# EAGLE design powerboard (EAGLE 7.6.0)
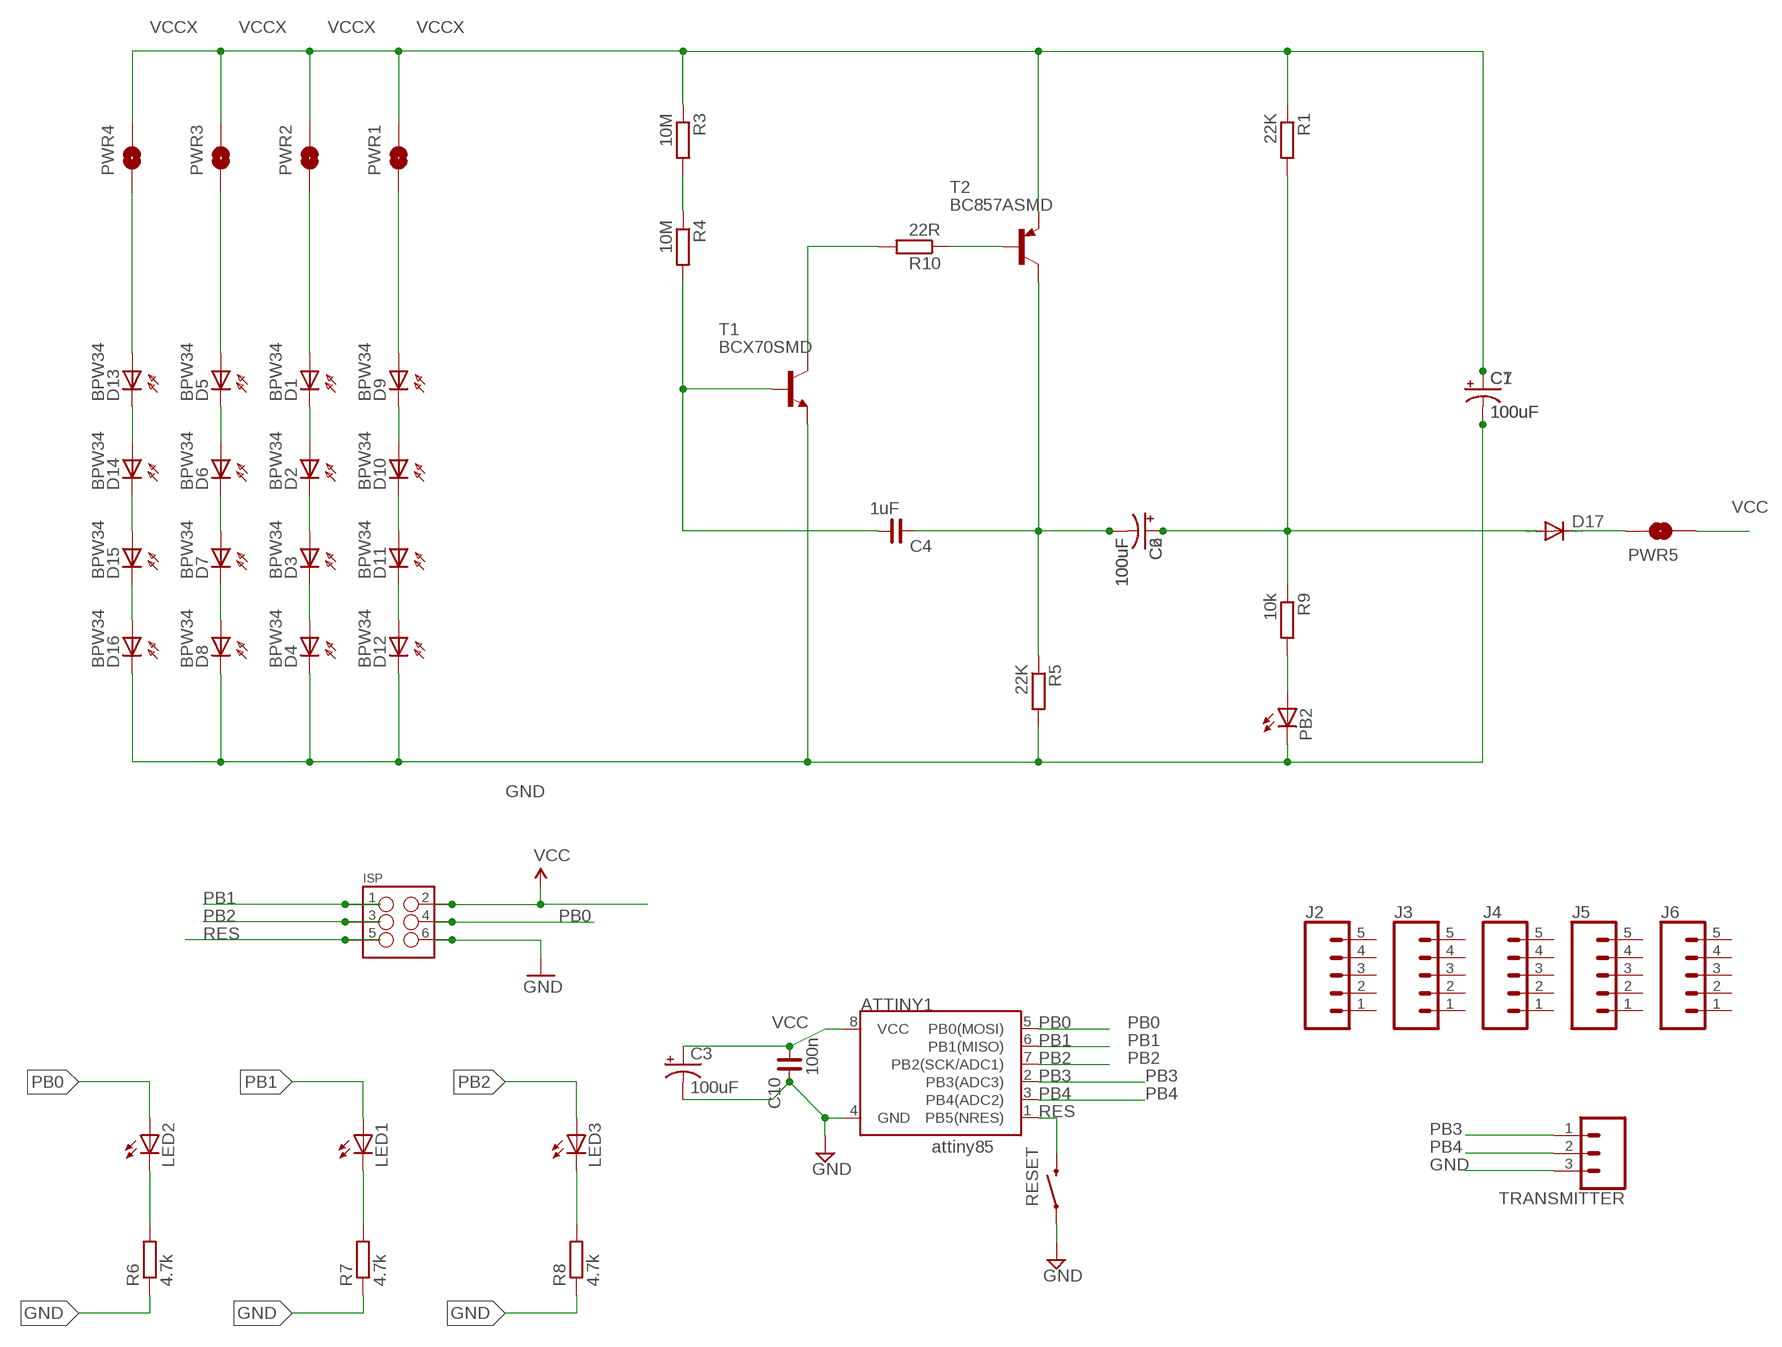
[diagram p0: schematic, sheet 1]

## Parts
ATTINY1  ATTINY45DIP8  [DIP08]
C1  100uF  CAP_POLPTH2  [CPOL-RADIAL-10UF-25V]
C2  100uF  CAP_POLPTH2  [CPOL-RADIAL-10UF-25V]
C3  100uF  CAP_POLPTH2  [CPOL-RADIAL-10UF-25V]
C4  1uF  C_0805  [C0805]
C6  100uF  CAP_POL1206  [EIA3216]
C7  100uF  CAP_POL1206  [EIA3216]
C10  100n  C_1206  [C1206]
D1  BPW34  BP104  [BP104]
D2  BPW34  BP104  [BP104]
D3  BPW34  BP104  [BP104]
D4  BPW34  BP104  [BP104]
D5  BPW34  BP104  [BP104]
D6  BPW34  BP104  [BP104]
D7  BPW34  BP104  [BP104]
D8  BPW34  BP104  [BP104]
D9  BPW34  BP104  [BP104]
D10  BPW34  BP104  [BP104]
D11  BPW34  BP104  [BP104]
D12  BPW34  BP104  [BP104]
D13  BPW34  BP104  [BP104]
D14  BPW34  BP104  [BP104]
D15  BPW34  BP104  [BP104]
D16  BPW34  BP104  [BP104]
D17  DIODE-DO214AA  [DO214AA]
ISP  M03X2NO_SILK  [2X3-NS@1]
J2  CONN_05NO_SILK  [1X05_NO_SILK]
J3  CONN_05NO_SILK  [1X05_NO_SILK]
J4  CONN_05NO_SILK  [1X05_NO_SILK]
J5  CONN_05NO_SILK  [1X05_NO_SILK]
J6  CONN_05NO_SILK  [1X05_NO_SILK]
LED1  LEDCHIPLED_1206  [CHIPLED_1206]
LED2  LEDCHIPLED_1206  [CHIPLED_1206]
LED3  LEDCHIPLED_1206  [CHIPLED_1206]
PB2  LEDKA-3528ASYC  [KA-3528ASYC]
PWR1  SOLDERJUMPERNO  [SJ_2S-NO]
PWR2  SOLDERJUMPERNO  [SJ_2S-NO]
PWR3  SOLDERJUMPERNO  [SJ_2S-NO]
PWR4  SOLDERJUMPERNO  [SJ_2S-NO]
PWR5  SOLDERJUMPERNO  [SJ_2S-NO]
R1  22K  R-EU_R0805W  [R0805W]
R3  10M  R-EU_R0805W  [R0805W]
R4  10M  R-EU_R0805W  [R0805W]
R5  22K  R-EU_R0805W  [R0805W]
R6  4.7k  R-EU_R1206W  [R1206W]
R7  4.7k  R-EU_R1206W  [R1206W]
R8  4.7k  R-EU_R1206W  [R1206W]
R9  10k  R-EU_R0805W  [R0805W]
R10  22R  R-EU_R0805  [R0805]
RESET  SWITCH-MOMENTARY-2PTH  [TACTILE-PTH]
T1  BCX70SMD  [SOT23]
T2  BC857ASMD  [SOT23-BEC]
TRANSMITTER  CONN_03LONGPADS  [1X03_LONGPADS]

## Nets
GND [c]: ATTINY1.4(GND) C1.2(-) C3.2(-) C7.C(-) C10.2 D4.K(C) D8.K(C) D12.K(C) D16.K(C) ISP.6 PB2.C R5.2 R6.1 R7.1 R8.1 RESET.1 T1.2(E) TRANSMITTER.3
N$1: R10.1 T2.B
N$2: R10.2 T1.3(C)
N$3: D9.A PWR1.1
N$4: C2.1(+) C6.A(+) D17.A R1.2 R9.1
N$5: R3.2 R4.1
N$6: LED2.C R6.2
N$7: D9.K(C) D10.A
N$8: D10.K(C) D11.A
N$9: C2.2(-) C4.2 C6.C(-) R5.1 T2.C
N$10: D11.K(C) D12.A
N$11: D1.A PWR2.1
N$12: D1.K(C) D2.A
N$13: D2.K(C) D3.A
N$14: D3.K(C) D4.A
N$15: D5.A PWR3.1
N$16: D5.K(C) D6.A
N$17: D6.K(C) D7.A
N$18: D7.K(C) D8.A
N$19: D13.A PWR4.1
N$20: D13.K(C) D14.A
N$21: D14.K(C) D15.A
N$22: D15.K(C) D16.A
N$23: LED1.C R7.2
N$24: LED3.C R8.2
N$25: PB2.A R9.2
N$26: D17.C PWR5.2
PB0: ATTINY1.5(PB0(MOSI)) ISP.4 LED2.A
PB1: ATTINY1.6(PB1(MISO)) ISP.1 LED1.A
PB2: ATTINY1.7(PB2(SCK/ADC1)) ISP.3 LED3.A
PB3: ATTINY1.2(PB3(ADC3)) TRANSMITTER.1
PB4: ATTINY1.3(PB4(ADC2)) TRANSMITTER.2
RES: ATTINY1.1(PB5(NRES)) ISP.5 RESET.3
VCC: ATTINY1.8(VCC) C3.1(+) C10.1 ISP.2 PWR5.1
VCCX: C1.1(+) C7.A(+) PWR1.2 PWR2.2 PWR3.2 PWR4.2 R1.1 R3.1 T2.E
XX: C4.1 R4.2 T1.1(B)
Unconnected: J2.1 J2.2 J2.3 J2.4 J2.5 J3.1 J3.2 J3.3 J3.4 J3.5 J4.1 J4.2 J4.3 J4.4 J4.5 J5.1 J5.2 J5.3 J5.4 J5.5 J6.1 J6.2 J6.3 J6.4 J6.5

## Notes on the sheet
- attiny85

## Library data of the parts
ATTINY1 = SparkFun:ATTINY45: Atmel ATTiny45
C1-C3 C6 C7 = SparkFun-Passives:CAP_POL: Capacitor Polarized These are standard SMD and PTH capacitors. Normally 10uF, 47uF, and 100uF in electrolytic and tantalum varieties. Always verify the external diameter of the through hole cap, it varies with capacity, voltage, and manufacturer. The EIA devices should be standard.
C4 C10 = rc-master-smd:C_: NON-POLARIZED CAP
D1-D16 = opto-trans-siemens:BP104: PHOTO DIODE
D17 = diode:DIODE-: DIODE
ISP = SparkFun-Connectors:M03X2: 2x3 .1" header. Shrouded, with keying- CONN-10681 SMT- CONN-11415 Pogo pins- HW-11044
J2-J6 = SparkFun-Connectors:CONN_05: Multi connection point. Often used as Generic Header-pin footprint for 0.1 inch spaced/style header connections On any of the 0.1 inch spaced packages, you can populate with these: Break Away Headers - Straight <https://www.sparkfun.com/products/116> (PRT-00116) Break Away Male Headers - Right Angle <https://www.sparkfun.com/products/553> (PRT-00553) Female Headers <https://www.sparkfun.com/products/115> (PRT-00115) Break Away Headers - Machine Pin <https://www.sparkfun.com/products/117> (PRT-00117) Break Away Female Headers - Swiss Machine Pin <https://www.sparkfun.com/products/743> (PRT-00743) For SCREWTERMINALS and SPRING TERMINALS visit here: Screw Terimnals on SparkFun.com <https://www.sparkfun.com/search/results?term=Screw+Terminals> (5mm/3.5mm/2.54mm spacing) This device is also useful as a general connection point to wire up your design to another part of your project. Our various solder wires solder well into these plated through hole pads. Hook-Up Wire - Assortment (Stranded, 22 AWG) <https://www.sparkfun.com/products/11375> (PRT-11375) Hook-Up Wire - Assortment (Solid Core, 22 AWG) <https://www.sparkfun.com/products/11367> (PRT-11367) View the entire wire category on our website here <https://www.sparkfun.com/categories/141> Special notes: Molex polarized connector foot print use with SKU : PRT-08231 with associated crimp pins and housings. 1MM SMD Version SKU: PRT-10208
LED1-LED3 PB2 = led:LED: LED OSRAM: - CHIPLED LG R971, LG N971, LY N971, LG Q971, LY Q971, LO R971, LY R971 LH N974, LH R974 LS Q976, LO Q976, LY Q976 LO Q996 - Hyper CHIPLED LW Q18S LB Q993, LB Q99A, LB R99A - SideLED LS A670, LO A670, LY A670, LG A670, LP A670 LB A673, LV A673, LT A673, LW A673 LH A674 LY A675 LS A676, LA A676, LO A676, LY A676, LW A676 LS A679, LY A679, LG A679 - Hyper Micro SIDELED® LS Y876, LA Y876, LO Y876, LY Y876 LT Y87S - SmartLED LW L88C, LW L88S LB L89C, LB L89S, LG L890 LS L89K, LO L89K, LY L89K LS L896, LA L896, LO L896, LY L896 - TOPLED LS T670, LO T670, LY T670, LG T670, LP T670 LSG T670, LSP T670, LSY T670, LOP T670, LYG T670 LG T671, LOG T671, LSG T671 LB T673, LV T673, LT T673, LW T673 LH T674 LS T676, LA T676, LO T676, LY T676, LB T676, LH T676, LSB T676, LW T676 LB T67C, LV T67C, LT T67C, LS T67K, LO T67K, LY T67K, LW E67C LS E67B, LA E67B, LO E67B, LY E67B, LB E67C, LV E67C, LT E67C LW T67C LS T679, LY T679, LG T679 LS T770, LO T770, LY T770, LG T770, LP T770 LB T773, LV T773, LT T773, LW T773 LH T774 LS E675, LA E675, LY E675, LS T675 LS T776, LA T776, LO T776, LY T776, LB T776 LHGB T686 LT T68C, LB T68C - Hyper Mini TOPLED® LB M676 - Mini TOPLED Santana® LG M470 LS M47K, LO M47K, LY M47K Source: http://www.osram.convergy.de LUXEON: - LUMILED® LXK2-PW12-R00, LXK2-PW12-S00, LXK2-PW14-U00, LXK2-PW14-V00 LXK2-PM12-R00, LXK2-PM12-S00, LXK2-PM14-U00 LXK2-PE12-Q00, LXK2-PE12-R00, LXK2-PE12-S00, LXK2-PE14-T00, LXK2-PE14-U00 LXK2-PB12-K00, LXK2-PB12-L00, LXK2-PB12-M00, LXK2-PB14-N00, LXK2-PB14-P00, LXK2-PB14-Q00 LXK2-PR12-L00, LXK2-PR12-M00, LXK2-PR14-Q00, LXK2-PR14-R00 LXK2-PD12-Q00, LXK2-PD12-R00, LXK2-PD12-S00 LXK2-PH12-R00, LXK2-PH12-S00 LXK2-PL12-P00, LXK2-PL12-Q00, LXK2-PL12-R00 Source: www.luxeon.com KINGBRIGHT: KA-3528ASYC Source: www.kingbright.com
PWR1-PWR5 = SparkFun:SOLDERJUMPER: Solder Jumper Standard SMD solder jumper. Used to automate production. Two varients : Normally Open and Normally Closed are the same, but have different paste layers. NC will have a large amount of paste and should jumper during reflow.
R1 R3-R5 R9 R10 = resistor:R-EU_: RESISTOR, European symbol
R6-R8 = rcl:R-EU_: RESISTOR, European symbol
RESET = SparkFun:SWITCH-MOMENTARY-2
T1 = transistor-npn:BCX70*: NPN Transistor
T2 = transistor-pnp:BC857*: PNP Transistror
TRANSMITTER = SparkFun-Connectors:CONN_03: Multi connection point. Often used as Generic Header-pin footprint for 0.1 inch spaced/style header connections On any of the 0.1 inch spaced packages, you can populate with these: Break Away Headers - Straight <https://www.sparkfun.com/products/116> (PRT-00116) Break Away Male Headers - Right Angle <https://www.sparkfun.com/products/553> (PRT-00553) Female Headers <https://www.sparkfun.com/products/115> (PRT-00115) Break Away Headers - Machine Pin <https://www.sparkfun.com/products/117> (PRT-00117) Break Away Female Headers - Swiss Machine Pin <https://www.sparkfun.com/products/743> (PRT-00743) Stackable Header - 3 Pin (Female, 0.1") <https://www.sparkfun.com/products/13875> (PRT-13875) For SCREWTERMINALS and SPRING TERMINALS visit here: Screw Terimnals on SparkFun.com <https://www.sparkfun.com/search/results?term=Screw+Terminals> (5mm/3.5mm/2.54mm spacing) This device is also useful as a general connection point to wire up your design to another part of your project. Our various solder wires solder well into these plated through hole pads. Hook-Up Wire - Assortment (Stranded, 22 AWG) <https://www.sparkfun.com/products/11375> (PRT-11375) Hook-Up Wire - Assortment (Solid Core, 22 AWG) <https://www.sparkfun.com/products/11367> (PRT-11367) View the entire wire category on our website here <https://www.sparkfun.com/categories/141> Special notes: Molex polarized connector foot print use with SKU : PRT-08232 with associated crimp pins and housings.

## Net classes
0 vcc: width 0.381 mm, drill 0.381 mm, clearance 0.381 mm
1 X: width 0.381 mm, drill 0.381 mm, clearance 0.381 mm
2 c: width 0.381 mm, drill 0.381 mm, clearance 0.381 mm

## Board
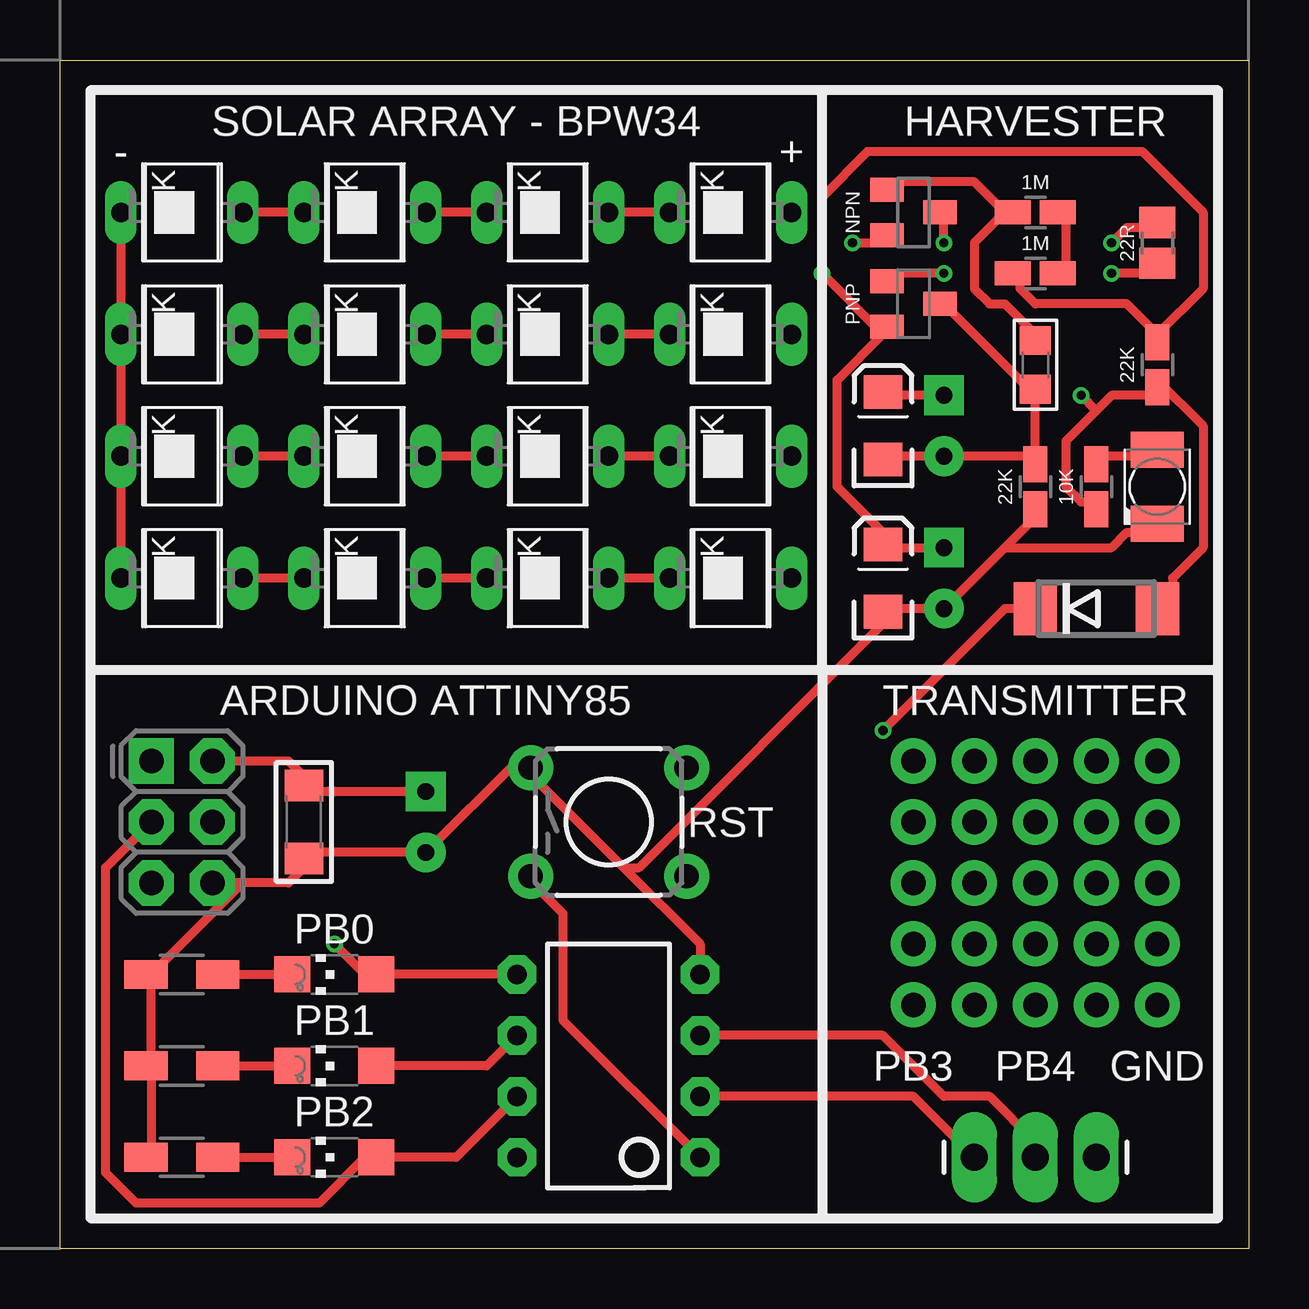
[diagram p1: board, top side]
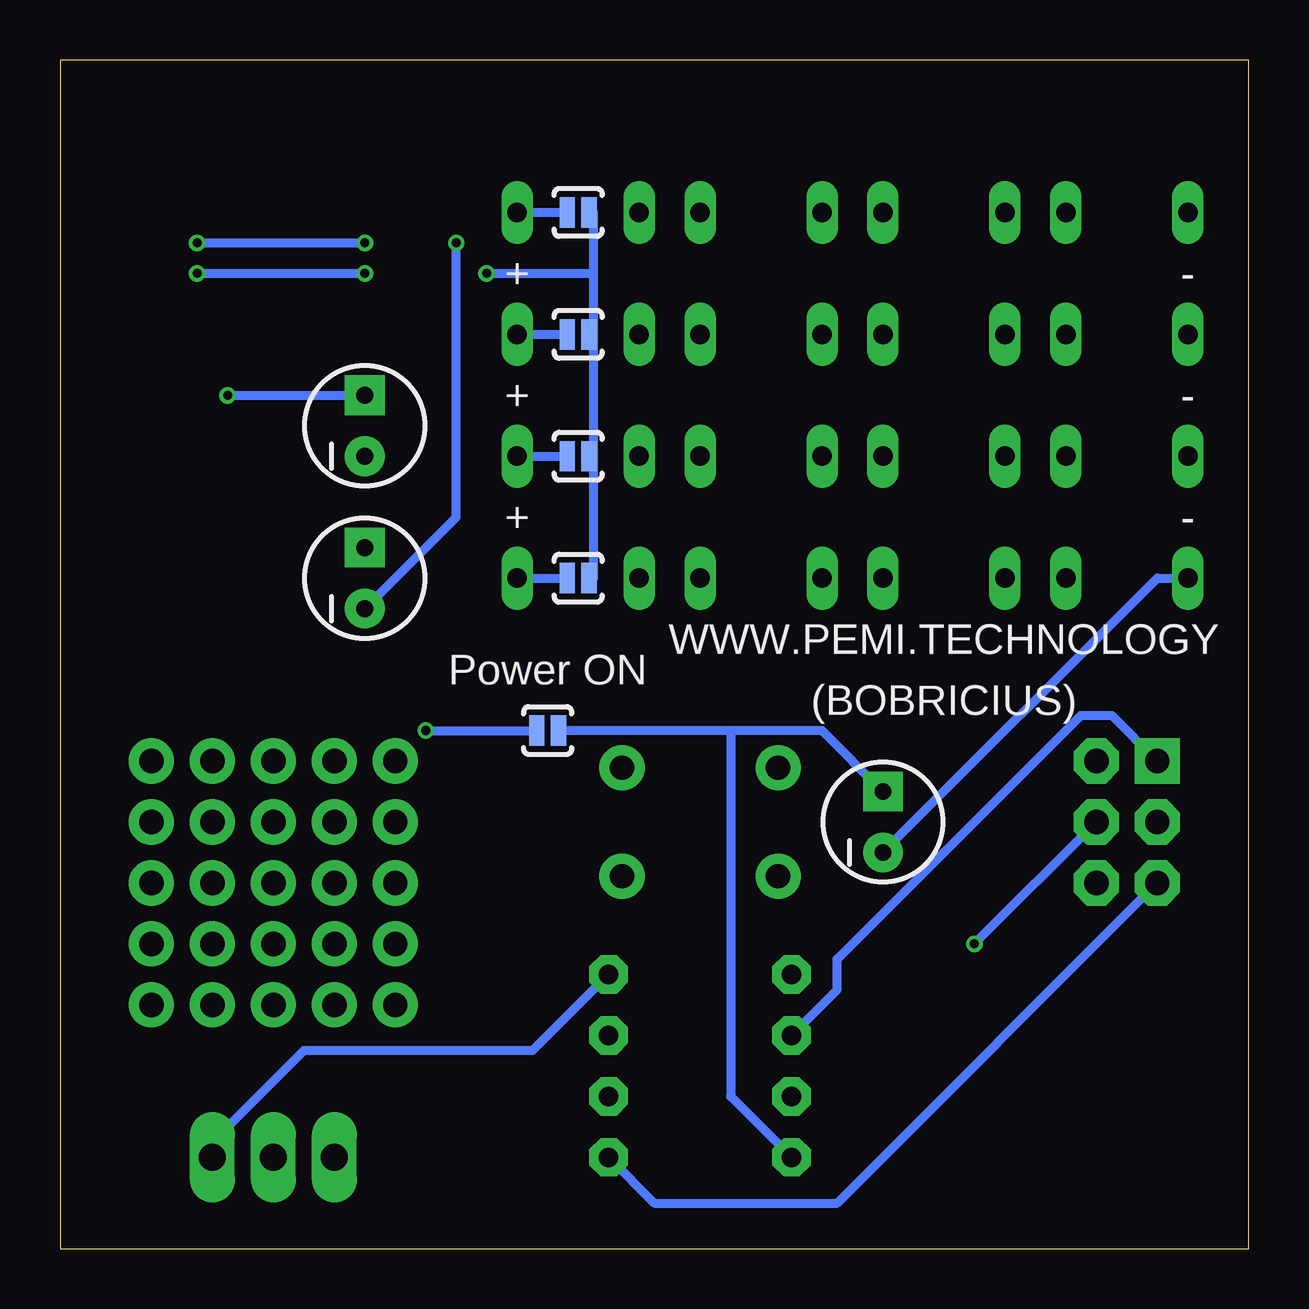
[diagram p2: board, bottom side, seen from below]

Size 49.53 x 49.53 mm. Coordinates in mm from the lower left corner, seen from the top.
Outline: 0,49.53 49.53,49.53 49.53,0 0,0 0,49.53
Copper layers (1*16): Top 0.035mm / dielectric 1.5mm / Bottom 0.035mm
Design rules "ITEADstudio_DRC *": minimum track width 6mil, minimum drill 12mil, track to track 6mil, track to pad 6mil, pad to pad 6mil, via to via 6mil, smd to smd 0mil, copper to edge 20mil, drill to drill 8mil, minimum pad ring 10mil, minimum via ring 6mil, stop-mask expansion 2mil, vias tented up to drill 100mil, thermal gap 10mil

### Footprints (pad centres in the part's own frame; a part is rotated, then mirrored left to right if it is on the bottom)
DIP08 = drill 0.813 pad 1.6 octagon: 1 -3.81,-3.81; 2 -1.27,-3.81; 3 1.27,-3.81; 4 3.81,-3.81; 5 3.81,3.81; 6 1.27,3.81; 7 -1.27,3.81; 8 -3.81,3.81
CPOL-RADIAL-10UF-25V = drill 0.7 pad 1.651 square: 1 1.27,0 | drill 0.7 pad 1.651: 2 -1.27,0
C0805 = smd 1.2 x 1.3: 1 -1.016,0; 2 1.016,0
EIA3216 = smd 1.4 x 1.6: A 1.4,0; C -1.4,0
C1206 = smd 1.3 x 1.6: 1 -1.524,0; 2 1.524,0
BP104 = drill 0.813 long: A 0,2.54; K 0,-2.54
DO214AA = smd 1.8 x 2.2: A 2.55,0; C -2.55,0
2X3-NS@1 = drill 1.016 pad 1.88 square: 1 -2.54,-1.27 | drill 1.016 pad 1.88 octagon: 2 -2.54,1.27; 3 0,-1.27; 4 0,1.27; 5 2.54,-1.27; 6 2.54,1.27
1X05_NO_SILK = drill 1.016 pad 1.88: 1 0,0; 2 2.54,0; 3 5.08,0; 4 7.62,0; 5 10.16,0
CHIPLED_1206 = smd 1.5 x 1.5: A 0,-1.75; C 0,1.75
KA-3528ASYC = smd 1.5 x 2.2: A -1.55,0; C 1.55,0
SJ_2S-NO = smd 0.635 x 1.27: 1 -0.45,0; 2 0.45,0
R0805W = smd 1.5 x 1: 1 -0.94,0; 2 0.94,0
R1206W = smd 1.8 x 1.2: 1 -1.499,0; 2 1.499,0
R0805 = smd 1.3 x 1.5: 1 -0.85,0; 2 0.85,0
TACTILE-PTH = drill 1.016 pad 1.88: 1 -3.251,2.261; 2 3.251,2.261; 3 -3.251,-2.261; 4 3.251,-2.261
SOT23 = smd 1 x 1.4: 1 -0.95,-1.1; 2 0.95,-1.1; 3 0,1.1
SOT23-BEC = smd 1 x 1.4: B -0.95,-1.1; C 0,1.1; E 0.95,-1.1
1X03_LONGPADS = drill 1.118 pad 1.88 long: 1 0,0; 2 2.54,0; 3 5.08,0

### Placement (x,y rotation side)
ATTINY1  22.86,7.62 90 top
C1  36.83,27.94 90 bottom
C2  36.83,34.29 90 bottom
C3  15.24,17.78 90 bottom
C4  40.64,36.83 270 top
C6  34.29,34.29 90 top
C7  34.29,27.94 90 top
C10  10.16,17.78 270 top
D1  27.94,38.1 270 top
D2  20.32,38.1 270 top
D3  12.7,38.1 270 top
D4  5.08,38.1 270 top
D5  27.94,43.18 270 top
D6  20.32,43.18 270 top
D7  12.7,43.18 270 top
D8  5.08,43.18 270 top
D9  27.94,33.02 270 top
D10  20.32,33.02 270 top
D11  12.7,33.02 270 top
D12  5.08,33.02 270 top
D13  27.94,27.94 270 top
D14  20.32,27.94 270 top
D15  12.7,27.94 270 top
D16  5.08,27.94 270 top
D17  43.18,26.67 0 top
ISP  5.08,17.78 270 top
J2  35.56,20.32 0 top
J3  35.56,17.78 0 top
J4  35.56,15.24 0 top
J5  35.56,12.7 0 top
J6  35.56,10.16 0 top
LED1  11.43,7.62 90 top
LED2  11.43,11.43 90 top
LED3  11.43,3.81 90 top
PB2  45.72,31.75 270 top
PWR1  27.94,33.02 0 bottom
PWR2  27.94,38.1 0 bottom
PWR3  27.94,43.18 0 bottom
PWR4  27.94,27.94 0 bottom
PWR5  29.21,21.59 180 bottom
R1  45.72,36.83 270 top
R3  40.64,40.64 0 top
R4  40.64,43.18 180 top
R5  40.64,31.75 270 top
R6  5.08,11.43 0 top
R7  5.08,7.62 0 top
R8  5.08,3.81 0 top
R9  43.18,31.75 90 top
R10  45.72,41.91 90 top
RESET  22.86,17.78 0 top
T1  35.56,43.18 270 top
T2  35.56,39.37 270 top
TRANSMITTER  38.1,3.81 0 top

### Tracks (layer width: path | path; a pad name or v marks a point on that pad's centre or on a via)
GND  (via drill 0.38)
  Top 0.381: D16.K D12.K D4.K D8.K | 3.81,7.62 3.81,3.81 R8.1 | 3.81,7.62 3.81,11.43 | 3.81,7.62 R7.1 | 7.62,15.24 9.53,15.24 10.16,15.88 C10.2 10.16,16.51 C3.2 19.05,20.32 RESET.1 19.68,19.68 23.5,15.88 | 7.62,15.24 ISP.6 | 7.62,15.24 3.81,11.43 | 3.81,11.43 R6.1 | v33.02,41.91 34.29,41.91 T1.2 | 39.37,29.21 C1.2 34.29,26.67 C7.C 34.29,26.04 24.13,15.88 23.5,15.88 | 39.37,29.21 40.64,30.48 R5.2 | 39.37,29.21 43.81,29.21 44.45,29.84 45.72,29.84 PB2.C | ATTINY1.4 26.67,12.7 23.5,15.88
  Bottom 0.381: D16.K 3.81,27.94 C3.2 | v33.02,41.91 33.02,30.48 C1.2 | TRANSMITTER.3 43.18,4.45 39.37,8.26 29.84,8.26 ATTINY1.4
N$1  (via drill 0.38)
  Top 0.381: v36.83,40.64 34.92,40.64 T2.B | v43.81,40.64 45.72,40.64 R10.1
  Bottom 0.381: v43.81,40.64 v36.83,40.64
N$2  (via drill 0.38)
  Top 0.381: v36.83,41.91 36.83,43.18 T1.3 | v43.81,41.91 44.45,42.54 45.72,42.54 R10.2
  Bottom 0.381: v43.81,41.91 v36.83,41.91
N$3
  Bottom 0.381: D9.A PWR1.1
N$4  (via drill 0.38)
  Top 0.381: C2.1 34.29,35.56 C6.A | 43.18,34.92 43.81,35.56 45.72,35.56 R1.2 45.72,36.2 47.62,34.29 47.62,29.21 46.35,27.94 46.35,26.67 D17.A | 43.18,34.92 41.91,33.65 41.91,31.75 42.54,31.11 43.18,31.11 R9.1 | 43.18,34.92 v42.54,35.56
  Bottom 0.381: v42.54,35.56 C2.1
N$5
  Top 0.381: R3.2 41.91,40.64 41.91,43.18 R4.1
N$6
  Top 0.381: R6.2 LED2.C
N$7
  Top 0.381: D9.K D10.A
N$8
  Top 0.381: D10.K D11.A
N$9
  Top 0.381: C6.C 34.29,33.02 C2.2 40.64,33.02 | 40.64,33.02 40.64,35.56 | 40.64,35.56 36.83,39.37 T2.C | 40.64,35.56 C4.2 | 40.64,33.02 R5.1
N$10
  Top 0.381: D11.K D12.A
N$11
  Bottom 0.381: D1.A PWR2.1
N$12
  Top 0.381: D1.K D2.A
N$13
  Top 0.381: D2.K D3.A
N$14
  Top 0.381: D3.K D4.A
N$15
  Bottom 0.381: D5.A PWR3.1
N$16
  Top 0.381: D5.K D6.A
N$17
  Top 0.381: D6.K D7.A
N$18
  Top 0.381: D7.K D8.A
N$19
  Bottom 0.381: D13.A PWR4.1
N$20
  Top 0.381: D13.K D14.A
N$21
  Top 0.381: D14.K D15.A
N$22
  Top 0.381: D15.K D16.A
N$23
  Top 0.381: R7.2 LED1.C
N$24
  Top 0.381: R8.2 LED3.C
N$25
  Top 0.381: R9.2 43.18,33.02 45.72,33.02 PB2.A
N$26  (via drill 0.38)
  Top 0.381: v34.29,21.59 39.37,26.67 D17.C
  Bottom 0.381: v34.29,21.59 PWR5.2
PB0  (via drill 0.38)
  Top 0.381: ATTINY1.5 LED2.A 12.7,11.43 v11.43,12.7
  Bottom 0.381: v11.43,12.7 ISP.4
PB1
  Top 0.381: LED1.A 17.78,7.62 ATTINY1.6
  Bottom 0.381: ISP.1 5.71,22.23 6.99,22.23 17.14,12.07 17.14,10.79 ATTINY1.6
PB2
  Top 0.381: ATTINY1.7 16.51,3.81 LED3.A 12.7,3.81 10.79,1.9 3.18,1.9 1.9,3.18 1.9,15.88 ISP.3
PB3
  Top 0.381: ATTINY1.2 35.56,6.35 TRANSMITTER.1
PB4
  Top 0.381: ATTINY1.3 34.29,8.89 36.83,6.35 38.73,6.35 40.64,4.45 TRANSMITTER.2
RES
  Top 0.381: ATTINY1.1 20.96,9.53 20.96,13.97 19.68,15.24 RESET.3
  Bottom 0.381: ISP.5 17.14,1.9 24.77,1.9 ATTINY1.1
VCC
  Top 0.381: C3.1 10.16,19.05 C10.1 10.16,19.68 9.53,20.32 ISP.2
  Bottom 0.381: 21.59,21.59 17.78,21.59 C3.1 | 21.59,21.59 PWR5.1 | ATTINY1.8 21.59,6.35 21.59,21.59
VCCX  (via drill 0.38)
  Top 0.381: 45.72,38.1 44.45,39.37 40.64,39.37 40,40 40,40.64 R3.1 | 34.29,38.1 32.38,36.2 32.38,31.75 34.29,29.84 C7.A 34.29,29.21 C1.1 | 45.72,38.1 47.62,40 47.62,43.18 45.08,45.72 33.65,45.72 31.75,43.81 v31.75,40.64 34.29,38.1 | 45.72,38.1 R1.1 | 34.29,38.1 T2.E
  Bottom 0.381: 27.3,33.02 27.3,27.94 PWR4.2 | 27.3,40.64 27.3,43.18 PWR3.2 | 27.3,40.64 27.3,38.1 | 27.3,38.1 27.3,33.02 | 27.3,33.02 PWR1.2 | 27.3,38.1 PWR2.2 | v31.75,40.64 27.3,40.64
XX
  Top 0.381: 39.37,43.18 38.1,41.91 38.1,40 38.73,39.37 39.37,39.37 40.64,38.1 C4.1 | 39.37,43.18 38.1,44.45 34.92,44.45 T1.1 | 39.37,43.18 R4.2

### Text on the board
tNames: SOLAR ARRAY - BPW34 | HARVESTER | - | + | 1M | NPN | 1M | 22R | PNP | 22K | 22K | 10K | ARDUINO ATTINY85 | TRANSMITTER | RST | PB0 | PB1 | PB3 | PB4 | GND | PB2
bNames: - | + | - | + | - | + | WWW.PEMI.TECHNOLOGY | Power ON | (BOBRICIUS)